# EAGLE design SRX-breakout (EAGLE 7.3.0)
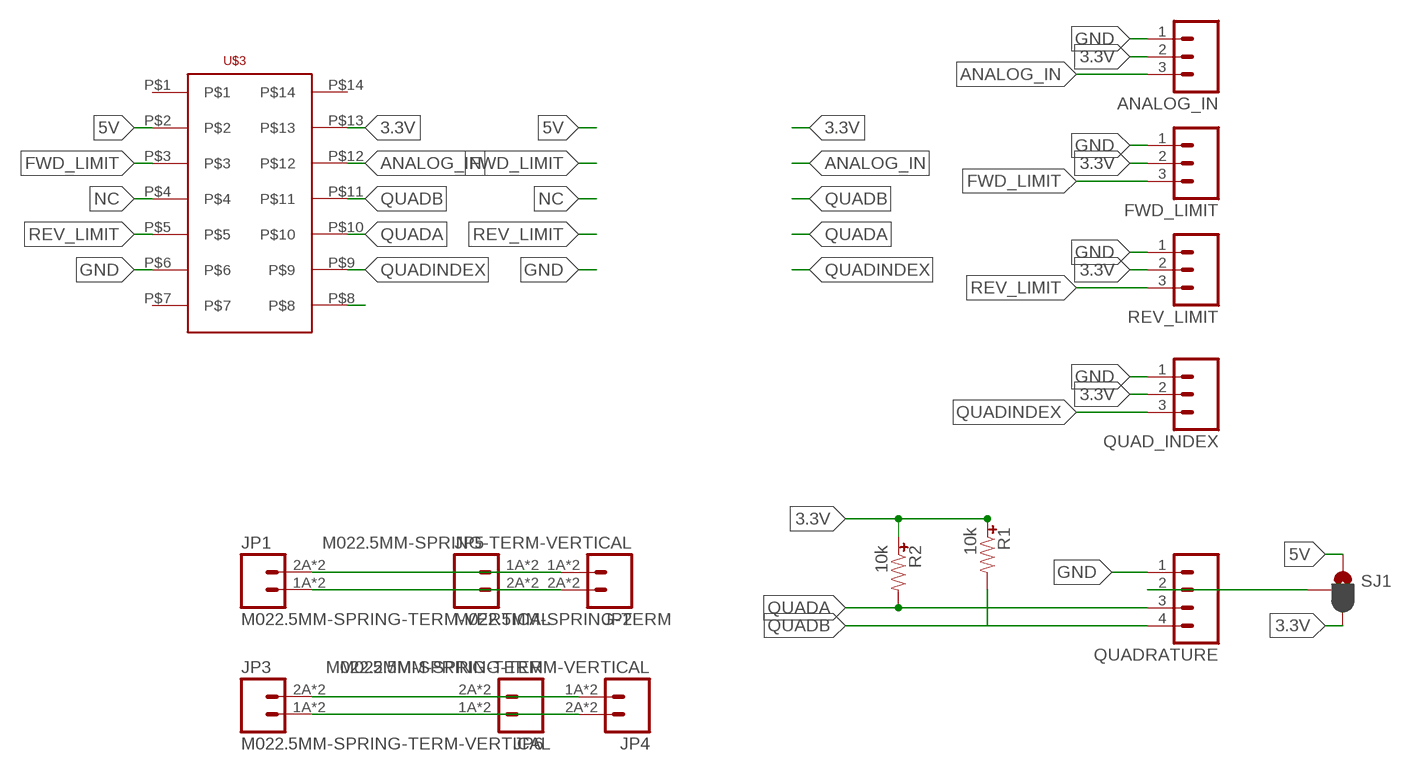
[diagram p0: schematic, sheet 1]

## Parts
ANALOG_IN  M03LOCK  [1X03_LOCK]
FWD_LIMIT  M03LOCK  [1X03_LOCK]
JP1  M022.5MM-SPRING-TERM-VERTICAL  [1824740000-2X-VERTICAL-SPRING-TERMINAL]
JP2  M022.5MM-SPRING-TERM-VERTICAL  [1824740000-2X-VERTICAL-SPRING-TERMINAL]
JP3  M022.5MM-SPRING-TERM-VERTICAL  [1824740000-2X-VERTICAL-SPRING-TERMINAL]
JP4  M022.5MM-SPRING-TERM-VERTICAL  [1824740000-2X-VERTICAL-SPRING-TERMINAL]
JP5  M022.5MM-SPRING-TERM  [1824740000-2X-STRAIGHT-SPRING-TERMINAL]
JP6  M022.5MM-SPRING-TERM  [1824740000-2X-STRAIGHT-SPRING-TERMINAL]
QUAD_INDEX  M03LOCK  [1X03_LOCK]
QUADRATURE  M04LOCK  [1X04_LOCK]
R1  10k  RESISTORUNIVERSAL  [0402-0603-0805-UNIVERSAL]
R2  10k  RESISTORUNIVERSAL  [0402-0603-0805-UNIVERSAL]
REV_LIMIT  M03LOCK  [1X03_LOCK]
SJ1  JUMPER-PAD-3-2OF3_NC_BY_PASTE  [PAD-JUMPER-3-2OF3_NC_BY_PASTE_YES_SILK_FULL_BOX]
U$3  M07X0220021321-00014TFLF  [M2X07_SMD]

## Nets
3.3V: ANALOG_IN.2 FWD_LIMIT.2 QUAD_INDEX.2 R1.+ R2.+ REV_LIMIT.2 SJ1.3 U$3.P$13
5V: SJ1.1 U$3.P$2
ANALOG_IN: ANALOG_IN.3 U$3.P$12
FWD_LIMIT: FWD_LIMIT.3 U$3.P$3
GND: ANALOG_IN.1 FWD_LIMIT.1 QUAD_INDEX.1 QUADRATURE.1 REV_LIMIT.1 U$3.P$6
N$1: JP3.2A JP3.2B JP4.1A JP4.1B JP6.2A JP6.2B
N$6: JP3.1A JP3.1B JP4.2A JP4.2B JP6.1A JP6.1B
N$7: JP1.1A JP1.1B JP2.2A JP2.2B JP5.2A JP5.2B
N$8: JP1.2A JP1.2B JP2.1A JP2.1B JP5.1A JP5.1B
NC: U$3.P$4
QUAD_VOLTAGE: QUADRATURE.2 SJ1.2
QUADA: QUADRATURE.3 R2.- U$3.P$10
QUADB: QUADRATURE.4 R1.- U$3.P$11
QUADINDEX: QUAD_INDEX.3 U$3.P$9
REV_LIMIT: REV_LIMIT.3 U$3.P$5
Unconnected: U$3.P$1 U$3.P$7 U$3.P$8 U$3.P$14

## Library data of the parts
ANALOG_IN FWD_LIMIT QUAD_INDEX REV_LIMIT = SparkFun-Connectors:M03: Header 3 Standard 3-pin 0.1" header. Use with straight break away headers (SKU : PRT-00116), right angle break away headers (PRT-00553), swiss pins (PRT-00743), machine pins (PRT-00117), and female headers (PRT-00115). Molex polarized connector foot print use with SKU : PRT-08232 with associated crimp pins and housings.
JP1-JP6 = tekdemo:M02: Standard 2-pin 0.1" header. Use with - straight break away headers ( PRT-00116) - right angle break away headers (PRT-00553) - swiss pins (PRT-00743) - machine pins (PRT-00117) - female headers (PRT-00115) Molex polarized connector foot print use with: PRT-08233 with associated crimp pins and housings. 2.54_SCREWTERM for use with PRT-10571. 3.5mm Screw Terminal footprints for PRT-08084 5mm Screw Terminal footprints for use with PRT-08432
QUADRATURE = SparkFun-Connectors:M04: Header 4 Standard 4-pin 0.1" header. Use with straight break away headers (SKU : PRT-00116), right angle break away headers (PRT-00553), swiss pins (PRT-00743), machine pins (PRT-00117), and female headers (PRT-00115). Molex polarized connector foot print use with SKU : PRT-08231 with associated crimp pins and housings. 1MM SMD Version SKU: PRT-10208
R1 R2 = tekdemo:RESISTOR: Resistor Basic schematic elements and footprints for 0603, 1206, and PTH resistors.
SJ1 = SparkFun-Passives:JUMPER-PAD-3-2OF3_NC_BY_PASTE
U$3 = tekdemo:M07X02

## Board
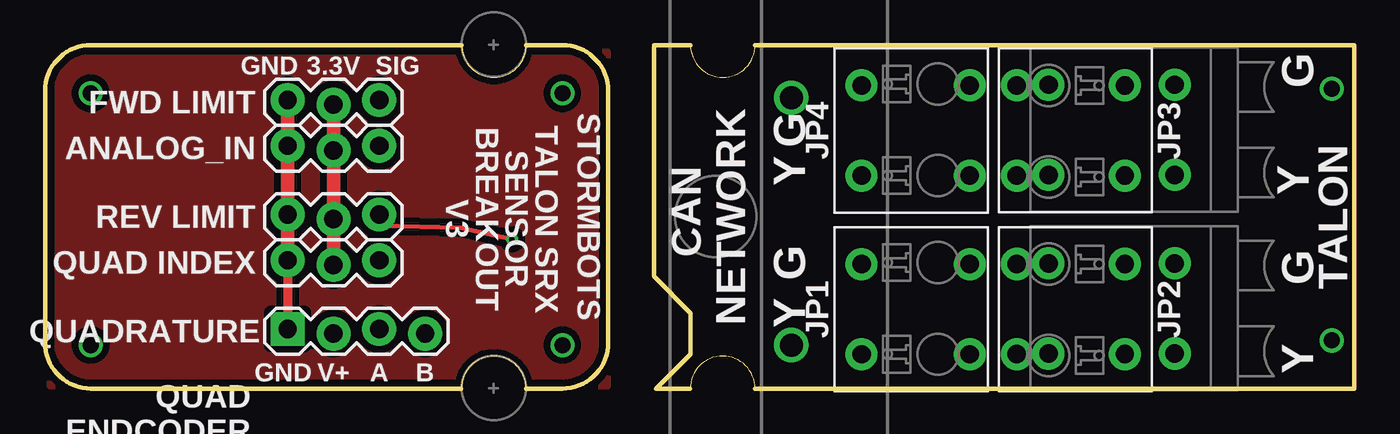
[diagram p1: board, top side]
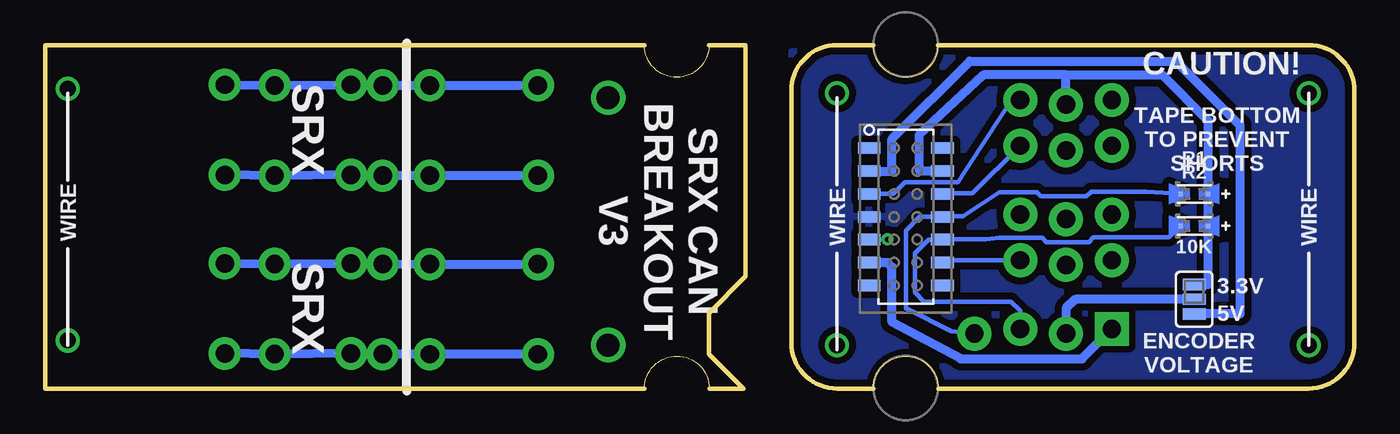
[diagram p2: board, bottom side, seen from below]

Size 72.64 x 19.05 mm. Coordinates in mm from the lower left corner, seen from the top.
Outline: 26.7,19.05 28.7,19.05 arc-90 31.24,16.51 31.24,2.54 arc-90 28.7,0 26.7,0 arc180 23.09,0 2.54,0 arc-90 0,2.54 0,16.51 arc-90 2.54,19.05 23.11,19.05 arc180 26.7,19.05
Outline: 72.64,19.05 72.64,0 39.39,0 arc180 35.79,0 33.91,0 35.81,1.91 35.81,4.19 33.78,6.22 33.78,18.92 33.78,19.05 35.81,19.05 arc180 39.39,19.05 72.64,19.05
Copper layers (1*16): Top 0.0356mm / dielectric 1.5011mm / Bottom 0.0356mm
Design rules "LaenPCBOrder *": minimum track width 6mil, minimum drill 13mil, track to track 6mil, track to pad 6mil, pad to pad 6mil, via to via 6mil, smd to smd 0mil, copper to edge 15mil, drill to drill 6mil, minimum pad ring 7mil, minimum via ring 7mil, stop-mask expansion 4mil, vias tented up to drill 15mil, thermal gap 10mil

### Footprints (pad centres in the part's own frame; a part is rotated, then mirrored left to right if it is on the bottom)
1X03_LOCK = drill 1.016 pad 1.88: 1 0,0.127; 2 2.54,-0.127; 3 5.08,0.127
1824740000-2X-VERTICAL-SPRING-TERMINAL = drill 1.016 pad 1.778: 1A 5,6.006; 1B 5,0.006; 2A 0,6.006; 2B 0,0.006
1824740000-2X-STRAIGHT-SPRING-TERMINAL = drill 1.016 pad 1.778: 1A 2.5,4; 1B 2.5,-3; 2A -2.5,4; 2B -2.5,-3
1X04_LOCK = drill 1.016 pad 1.88 square: 1 0,0.127 | drill 1.016 pad 1.88: 2 2.54,-0.127; 3 5.08,0.127; 4 7.62,-0.127
0402-0603-0805-UNIVERSAL = smd 0.254 x 0.254: + -0.762,0; - 0.762,0
PAD-JUMPER-3-2OF3_NC_BY_PASTE_YES_SILK_FULL_BOX = smd 0.635 x 1.27: 1 -0.813,0; 2 0,0; 3 0.813,0
M2X07_SMD = smd 0.635 x 1.27: P$1 -3.81,-2.032; P$2 -2.54,-2.032; P$3 -1.27,-2.032; P$4 0,-2.032; P$5 1.27,-2.032; P$6 2.54,-2.032; P$7 3.81,-2.032; P$8 3.81,2.032; P$9 2.54,2.032; P$10 1.27,2.032; P$11 0,2.032; P$12 -1.27,2.032; P$13 -2.54,2.032; P$14 -3.81,2.032

### Placement (x,y rotation side)
ANALOG_IN  13.46,13.34 0 top
FWD_LIMIT  13.46,15.88 0 top
JP1  51.31,1.91 90 top
JP2  53.9,6.91 270 top
JP3  53.9,16.81 270 top
JP4  51.31,11.81 90 top
JP5  58.67,4.45 270 top
JP6  58.67,14.35 270 top
QUAD_INDEX  13.46,6.98 0 top
QUADRATURE  13.46,3.18 0 top
R1  8.89,10.8 180 bottom
R2  8.89,9.02 180 bottom
REV_LIMIT  13.46,9.53 0 top
SJ1  8.89,4.95 90 bottom
U$1  [TALONSRX]  24.89,9.55 0 top
U$3  24.89,9.53 270 bottom

### Tracks (layer width: path | path; a pad name or v marks a point on that pad's centre or on a via)
3.3V
  Top 0.762: REV_LIMIT.2 ANALOG_IN.2 QUAD_INDEX.2 FWD_LIMIT.2
  Bottom 0.508: FWD_LIMIT.2 16,17.4 | 16,17.4 20.57,17.4 24.13,14.1 24.13,12.07 U$3.P$13 | 16,17.4 10.67,17.4 8.13,14.86 R1.+ R2.+ 8.13,5.77 SJ1.3
5V
  Bottom 0.508: SJ1.1 6.35,4.14 6.35,14.61 9.91,18.16 21.34,18.16 25.65,13.84 25.65,12.07 U$3.P$2
ANALOG_IN
  Bottom 0.254: U$3.P$12 22.84,10.82 21.18,10.82 ANALOG_IN.3
FWD_LIMIT
  Bottom 0.254: FWD_LIMIT.3 19.03,16 22,11.43 24.94,11.43 25.58,10.8 U$3.P$3
GND
  Top 0.508: QUAD_INDEX.1 QUADRATURE.1 13.46,3.43
  Top 0.762: REV_LIMIT.1 ANALOG_IN.1 QUAD_INDEX.1 FWD_LIMIT.1
  Bottom 0.508: QUADRATURE.1 15.11,1.65 21.84,1.65 25.65,3.68 25.65,6.73 25.91,6.98 U$3.P$6
N$1
  Bottom 0.508: JP6.2A JP3.2A JP6.2B JP3.2B JP4.1B JP4.1A
N$2  (via drill 0.89)
  other vias: 28.7,2.41
N$3  (via drill 0.89)
  other vias: 28.7,16.38
N$4  (via drill 0.89)
  other vias: 2.54,2.41
N$5  (via drill 0.89)
  other vias: 2.54,16.38
N$6
  Bottom 0.508: JP4.2A JP4.2B JP3.1B JP6.1B JP3.1A JP6.1A
N$7
  Bottom 0.508: JP5.2A JP2.2A JP5.2B JP2.2B JP1.1B JP1.1A
N$8
  Bottom 0.508: JP1.2A JP1.2B JP2.1B JP5.1B JP2.1A JP5.1A
N$9  (via drill 1.27)
  other vias: 41.4,16.13
N$10  (via drill 1.27)
  other vias: 41.4,2.41
N$11  (via drill 0.89)
  other vias: 71.37,2.67
N$12  (via drill 0.89)
  other vias: 71.37,16.64
N$13
  pour Top (isolate 0.381): 0.25,18.67 0.25,0.13 22.35,0.13 24.89,1.91 26.67,0.13 31.24,0.13 31.24,18.67 26.67,18.67 24.89,17.14 23.11,18.67
NC
  pour Bottom (isolate 0.381): 0.51,0.38 0.25,18.67 23.11,18.67 24.89,17.14 26.67,18.67 31.24,18.67 31.24,0.63 26.16,0.63 24.89,1.91 23.62,0.63
QUAD_VOLTAGE
  Bottom 0.508: SJ1.2 15.49,4.95 16,4.45 QUADRATURE.2
QUADA
  Bottom 0.254: QUADRATURE.3 18.54,4.32 19.05,4.83 23.88,4.83 24.38,5.33 24.38,7.52 23.65,8.26 U$3.P$10 22.84,8.28 20.45,8.28 19.71,8.36 17.32,8.36 17.09,8.13 14.73,8.13 14.48,8.38 10.29,8.38 R2.-
QUADB
  Bottom 0.254: R1.- 11.56,10.92 14.61,10.92 14.86,10.67 17.4,10.67 17.63,10.9 19.71,10.9 21.72,9.55 22.84,9.55 U$3.P$11 24.13,9.53 24.89,8.76 24.89,4.45 22.35,3.18 QUADRATURE.4
QUADINDEX
  Bottom 0.254: U$3.P$9 22.73,7.11 QUAD_INDEX.3
REV_LIMIT  (via drill 0.3)
  Top 0.254: REV_LIMIT.3 18.54,9.02 23.04,8.92 v25.91,8.28
  Bottom 0.254: U$3.P$5 25.93,8.26 v25.91,8.28

### Text on the board
tPlace: GND | 3.3V | SIG | G | FWD LIMIT | G | ANALOG_IN | Y | Y | REV LIMIT | TALON SRX / SENSOR / BREAKOUT / V3 | STORMBOTS | CAN / NETWORK | TALON | QUAD INDEX | G | G | Y | QUADRATURE | GND | V+ | A | B | Y | QUAD / ENDCODER
bPlace: CAUTION! | TAPE BOTTOM / TO PREVENT / SHORTS | SRX | WIRE | WIRE | SRX CAN / BREAKOUT / V3 | WIRE | 10K | 3.3V | 5V | SRX | ENCODER / VOLTAGE